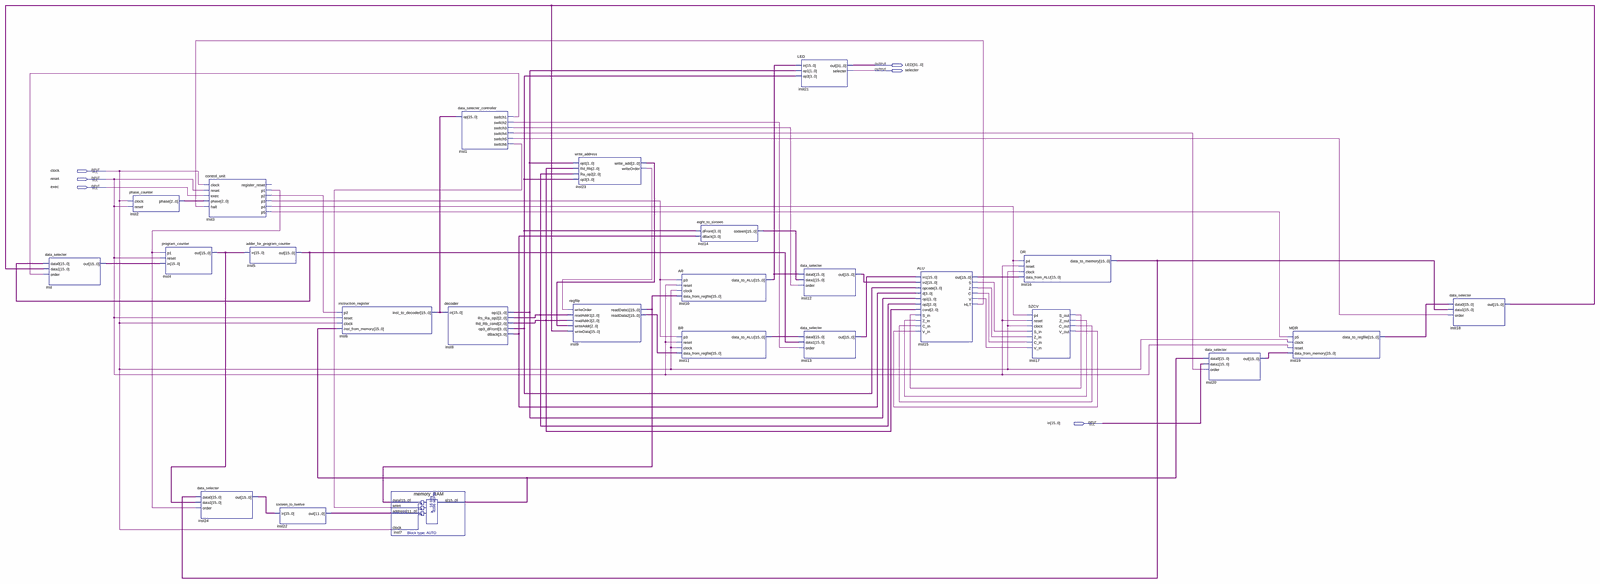
[diagram p0: schematic sheet, whole]
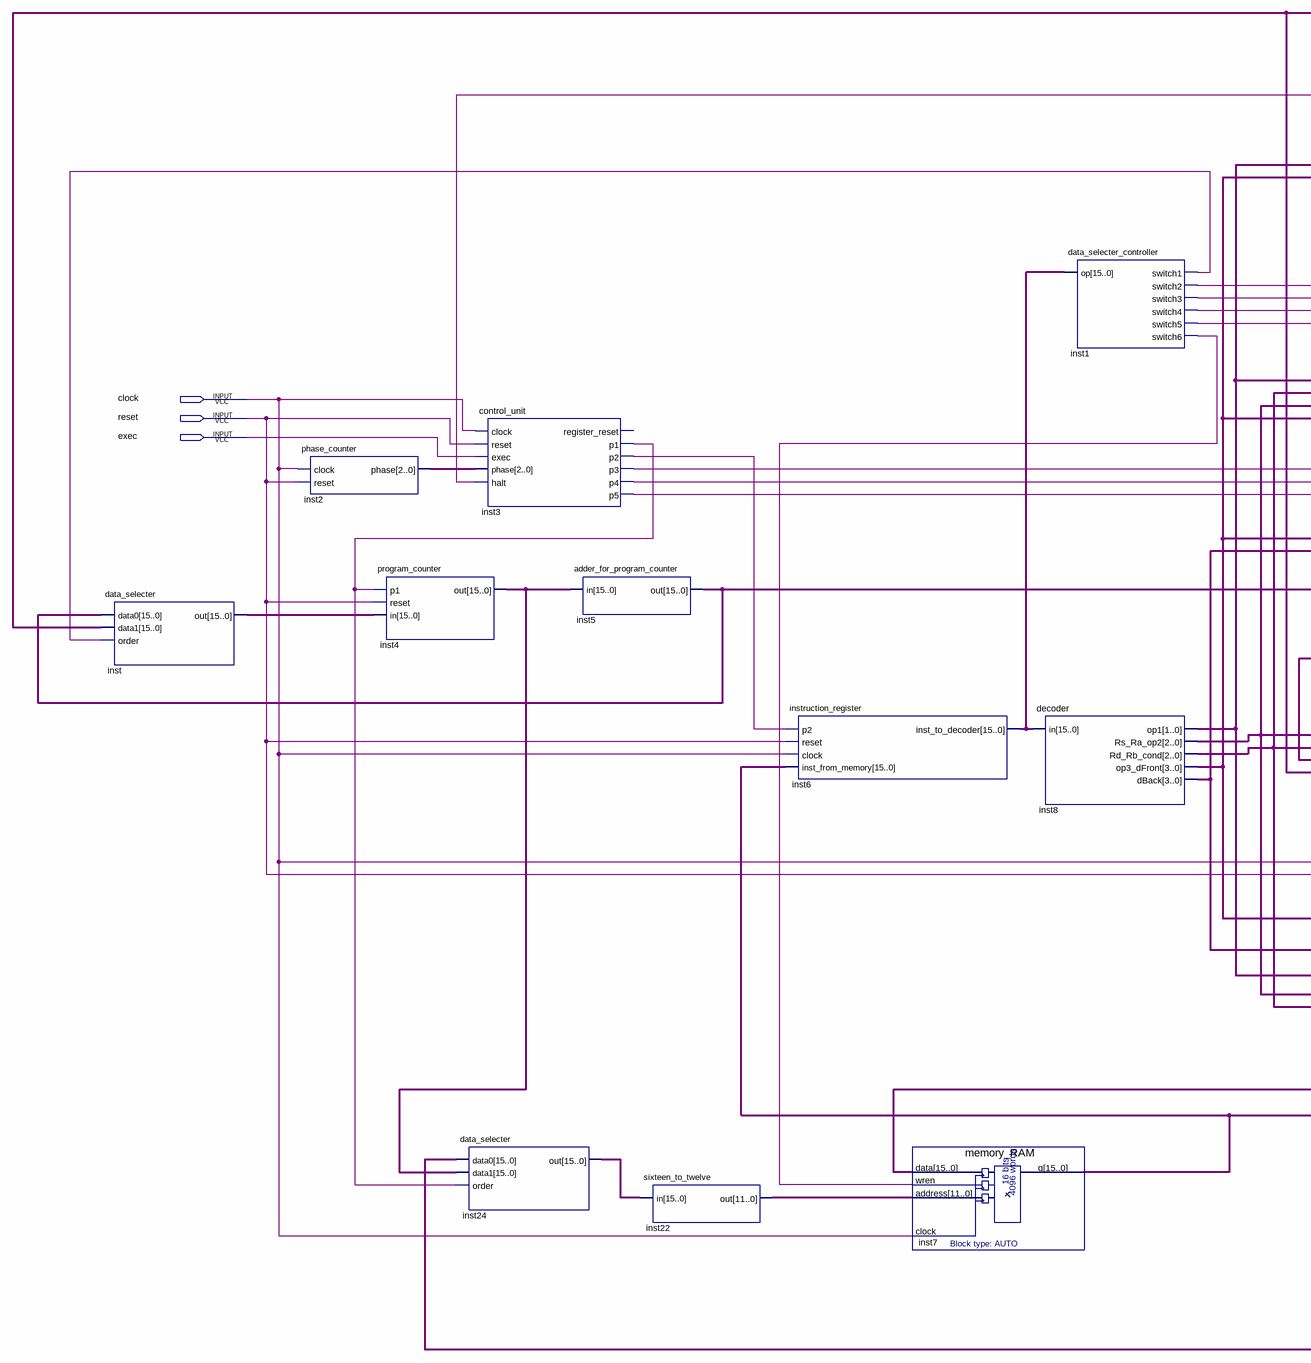
[diagram p1: schematic sheet, left part]
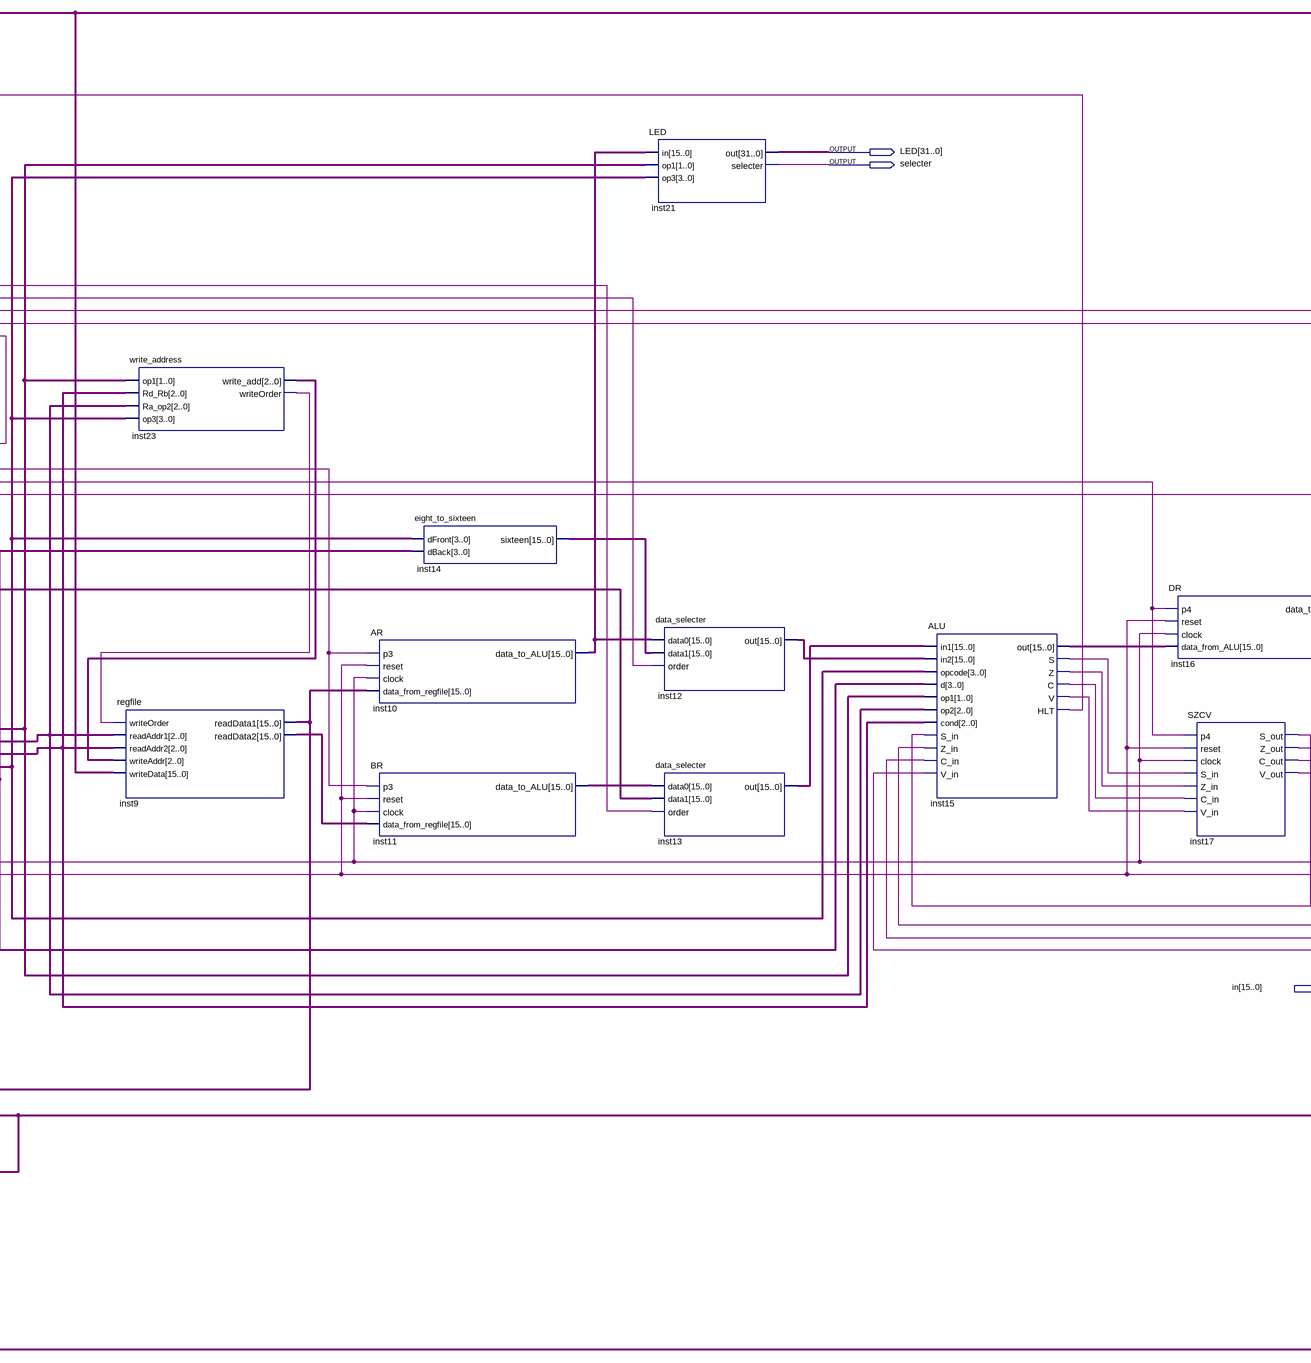
[diagram p2: schematic sheet, centre part]
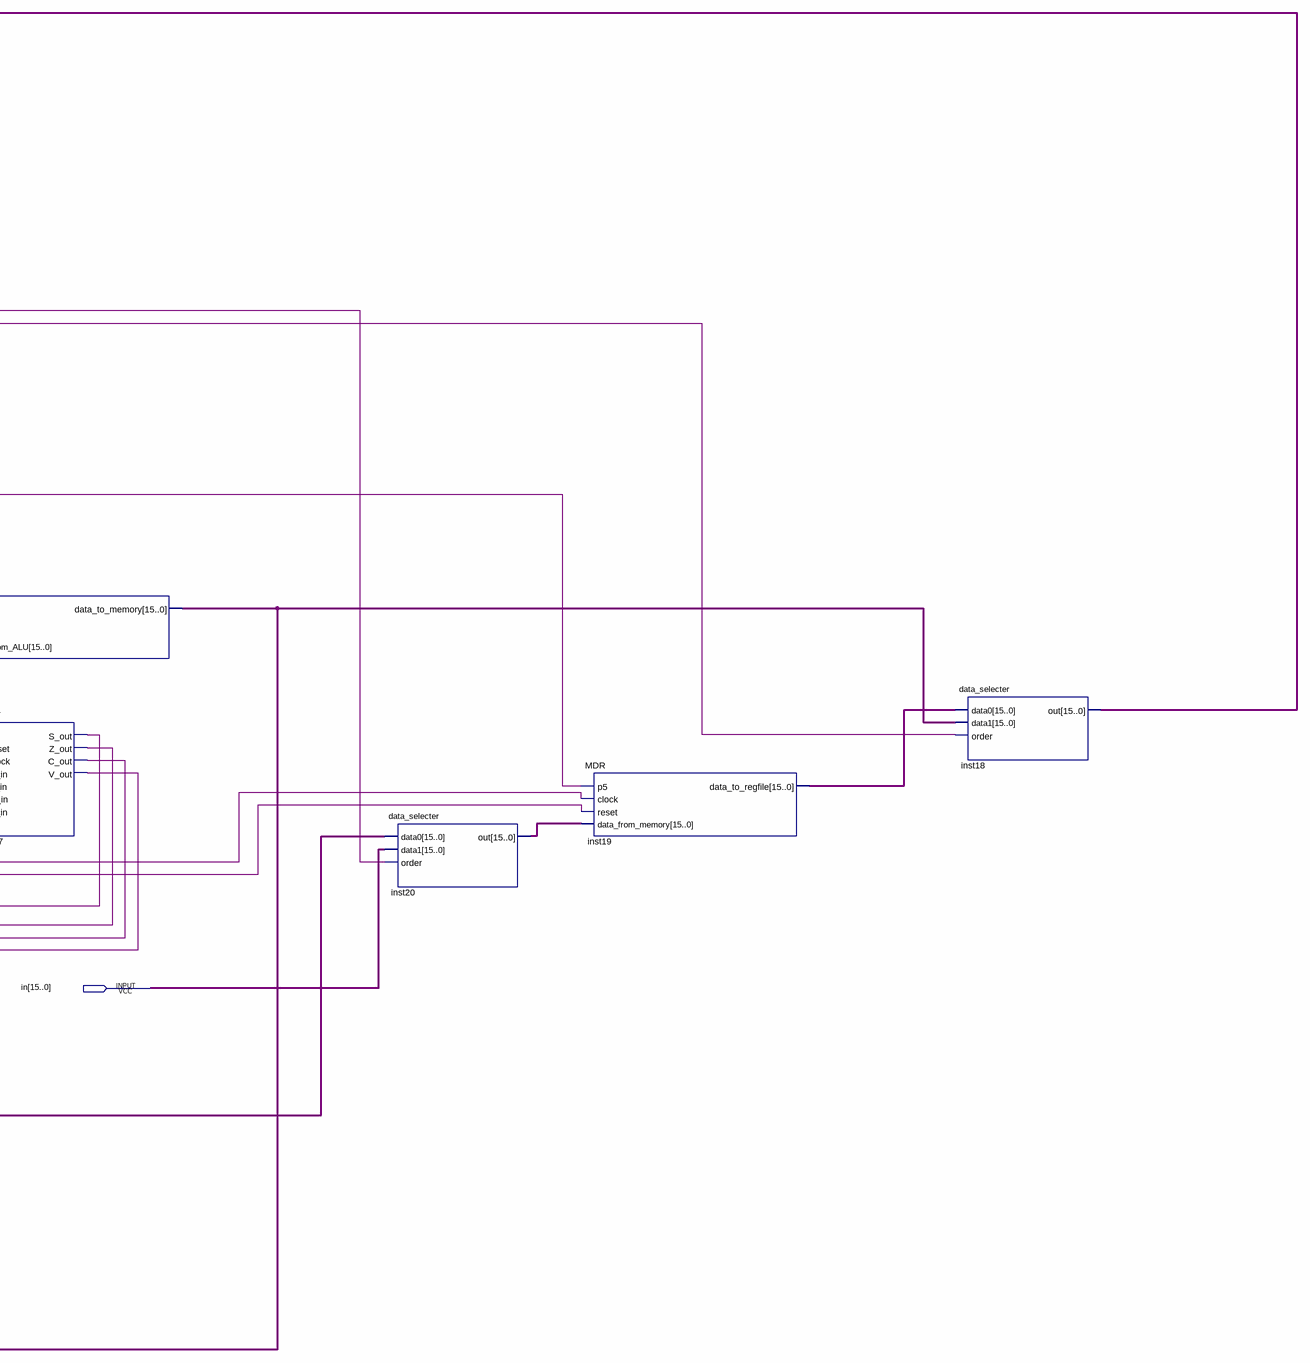
[diagram p3: schematic sheet, right part]
// Quartus schematic processor.bdf as structural Verilog: 25 symbols, 6 pins
module processor (
  input  clock,
  input  reset,
  input  exec,
  input  [15:0] in,
  output [31:0] LED,
  output selecter
);

  wire inst1_switch1, inst1_switch2, inst1_switch3, inst1_switch4, inst1_switch5, inst1_switch6, inst3_p1,
       inst3_p2, inst3_p3, inst3_p4, inst3_p5, inst15_c, inst15_hlt, inst15_s, inst15_v, inst15_z,
       inst17_c_out, inst17_s_out, inst17_v_out, inst17_z_out, inst23_writeorder;
  wire [1:0] inst8_op1;
  wire [2:0] inst2_phase, inst8_rd_rb_cond, inst8_rs_ra_op2, inst23_write_add;
  wire [3:0] inst8_dback, inst8_op3_dfront;
  wire [11:0] inst22_out;
  wire [15:0] inst4_out, inst5_out, inst6_inst_to_decoder, inst7_q, inst9_readdata1, inst9_readdata2,
       inst10_data_to_alu, inst11_data_to_alu, inst12_out, inst13_out, inst14_sixteen, inst15_out,
       inst16_data_to_memory, inst18_out, inst19_data_to_regfile, inst20_out, inst24_out, inst_out;

  data_selecter inst (.data0(inst5_out), .data1(inst18_out), .order(inst1_switch1), .out(inst_out));
  phase_counter inst2 (.clock(clock), .reset(reset), .phase(inst2_phase));
  program_counter inst4 (.p1(inst3_p1), .reset(reset), .in(inst_out), .out(inst4_out));
  data_selecter inst24 (.data0(inst16_data_to_memory), .data1(inst4_out), .order(inst3_p1), .out(inst24_out));
  control_unit inst3 (
    .clock(clock), .reset(reset), .exec(exec), .phase(inst2_phase), .halt(inst15_hlt), .p1(inst3_p1),
    .p2(inst3_p2), .p3(inst3_p3), .p4(inst3_p4), .p5(inst3_p5));  // open: register_reset
  adder_for_program_counter inst5 (.in(inst4_out), .out(inst5_out));
  sixteen_to_twelve inst22 (.in(inst24_out), .out(inst22_out));
  instruction_register inst6 (
    .p2(inst3_p2), .reset(reset), .clock(clock), .inst_from_memory(inst7_q),
    .inst_to_decoder(inst6_inst_to_decoder));
  memory_RAM inst7 (.data(inst9_readdata1), .wren(inst1_switch6), .address(inst22_out), .clock(clock), .q(inst7_q));
  data_selecter_controller inst1 (
    .op(inst6_inst_to_decoder), .switch1(inst1_switch1), .switch2(inst1_switch2), .switch3(inst1_switch3),
    .switch4(inst1_switch4), .switch5(inst1_switch5), .switch6(inst1_switch6));
  decoder inst8 (
    .in(inst6_inst_to_decoder), .op1(inst8_op1), .Rs_Ra_op2(inst8_rs_ra_op2), .Rd_Rb_cond(inst8_rd_rb_cond),
    .op3_dFront(inst8_op3_dfront), .dBack(inst8_dback));
  write_address inst23 (
    .op1(inst8_op1), .Rd_Rb(inst8_rd_rb_cond), .Ra_op2(inst8_rs_ra_op2), .op3(inst8_op3_dfront),
    .write_add(inst23_write_add), .writeOrder(inst23_writeorder));
  regfile inst9 (
    .writeOrder(inst23_writeorder), .readAddr1(inst8_rs_ra_op2), .readAddr2(inst8_rd_rb_cond),
    .writeAddr(inst23_write_add), .writeData(inst18_out), .readData1(inst9_readdata1),
    .readData2(inst9_readdata2));
  eight_to_sixteen inst14 (.dFront(inst8_op3_dfront), .dBack(inst8_dback), .sixteen(inst14_sixteen));
  AR inst10 (
    .p3(inst3_p3), .reset(reset), .clock(clock), .data_from_regfile(inst9_readdata1),
    .data_to_ALU(inst10_data_to_alu));
  BR inst11 (
    .p3(inst3_p3), .reset(reset), .clock(clock), .data_from_regfile(inst9_readdata2),
    .data_to_ALU(inst11_data_to_alu));
  LED inst21 (.in(inst10_data_to_alu), .op1(inst8_op1), .op3(inst8_op3_dfront), .out(LED), .selecter(selecter));
  data_selecter inst12 (.data0(inst10_data_to_alu), .data1(inst14_sixteen), .order(inst1_switch3), .out(inst12_out));
  data_selecter inst13 (.data0(inst11_data_to_alu), .data1(inst5_out), .order(inst1_switch2), .out(inst13_out));
  ALU inst15 (
    .in1(inst13_out), .in2(inst12_out), .opcode(inst8_op3_dfront), .d(inst8_dback), .op1(inst8_op1),
    .op2(inst8_rs_ra_op2), .cond(inst8_rd_rb_cond), .S_in(inst17_s_out), .Z_in(inst17_z_out),
    .C_in(inst17_c_out), .V_in(inst17_v_out), .out(inst15_out), .S(inst15_s), .Z(inst15_z), .C(inst15_c),
    .V(inst15_v), .HLT(inst15_hlt));
  DR inst16 (
    .p4(inst3_p4), .reset(reset), .clock(clock), .data_from_ALU(inst15_out),
    .data_to_memory(inst16_data_to_memory));
  SZCV inst17 (
    .p4(inst3_p4), .reset(reset), .clock(clock), .S_in(inst15_s), .Z_in(inst15_z), .C_in(inst15_c),
    .V_in(inst15_v), .S_out(inst17_s_out), .Z_out(inst17_z_out), .C_out(inst17_c_out), .V_out(inst17_v_out));
  data_selecter inst20 (.data0(inst7_q), .data1(in), .order(inst1_switch4), .out(inst20_out));
  MDR inst19 (
    .p5(inst3_p5), .clock(clock), .reset(reset), .data_from_memory(inst20_out),
    .data_to_regfile(inst19_data_to_regfile));
  data_selecter inst18 (
    .data0(inst19_data_to_regfile), .data1(inst16_data_to_memory), .order(inst1_switch5), .out(inst18_out));
endmodule
